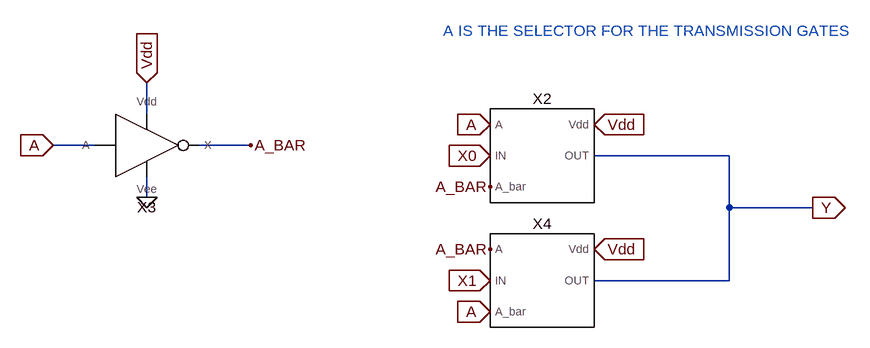
[diagram p0: schematic 2x1_MUX.asc]
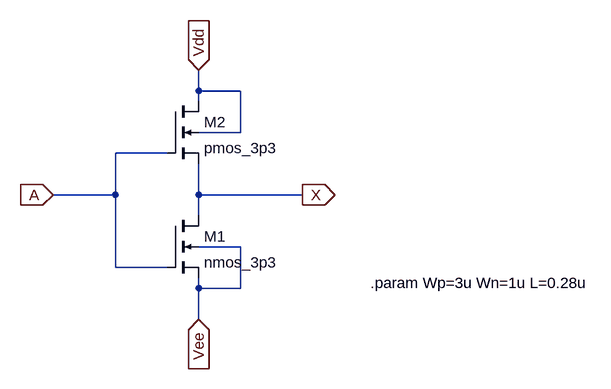
[diagram p1: sub-circuit invx1.asc]
2x1_MUX.asc, the LTspice schematic file:
Version 4
SHEET 1 1144 680
WIRE -160 16 -160 -32
WIRE -240 64 -304 64
WIRE 0 64 -80 64
WIRE 736 80 528 80
WIRE -160 144 -160 112
WIRE 736 160 736 80
WIRE 864 160 736 160
WIRE 736 272 736 160
WIRE 736 272 528 272
FLAG 528 32 Vdd
IOPIN 528 32 In
FLAG 368 80 X0
IOPIN 368 80 In
FLAG 368 32 A
IOPIN 368 32 In
FLAG -304 64 A
IOPIN -304 64 In
FLAG 0 64 A_BAR
FLAG 368 128 A_BAR
FLAG 528 224 Vdd
IOPIN 528 224 In
FLAG 864 160 Y
IOPIN 864 160 Out
FLAG 368 272 X1
IOPIN 368 272 In
FLAG 368 320 A
IOPIN 368 320 In
FLAG 368 224 A_BAR
FLAG -160 144 0
FLAG -160 -32 Vdd
IOPIN -160 -32 In
SYMBOL TGATE 448 80 R0
SYMATTR InstName X2
SYMBOL INVx1 -160 64 R0
SYMATTR InstName X3
SYMBOL TGATE 448 272 R0
SYMATTR InstName X4
TEXT 296 -112 Left 2 ;A IS THE SELECTOR FOR THE TRANSMISSION GATES

invx1.asc, the sub-circuit schematic file:
Version 4
SHEET 1 2776 836
WIRE 416 -16 416 -48
WIRE 480 -16 416 -16
WIRE 416 0 416 -16
WIRE 480 48 480 -16
WIRE 480 48 416 48
WIRE 368 80 288 80
WIRE 288 144 288 80
WIRE 288 144 192 144
WIRE 416 144 416 96
WIRE 576 144 416 144
WIRE 416 176 416 144
WIRE 480 224 416 224
WIRE 288 256 288 144
WIRE 368 256 288 256
WIRE 416 288 416 272
WIRE 480 288 480 224
WIRE 480 288 416 288
WIRE 416 336 416 288
FLAG 416 -48 Vdd
IOPIN 416 -48 In
FLAG 192 144 A
IOPIN 192 144 In
FLAG 576 144 X
IOPIN 576 144 Out
FLAG 416 336 Vee
IOPIN 416 336 In
SYMBOL nmos4 368 176 R0
SYMATTR InstName M1
SYMATTR Value nmos_3p3
SYMATTR Value2 l={L} w={Wn}
SYMBOL nmos4 368 0 R0
SYMATTR InstName M2
SYMATTR Value pmos_3p3
SYMATTR Value2 l={L} w={Wp}
TEXT 680 280 Left 2 !.param Wp=3u Wn=1u L=0.28u

The netlist it stands for:
* 2x1_MUX.asc
XX2 A A_BAR X0 Vdd Y TGATE L=0.28u Wn=1u Wp=3u M=1  ; pins A A_bar IN Vdd OUT
XX3 A Vdd A_BAR 0 invx1
XX4 A_BAR A X1 Vdd Y TGATE L=0.28u Wn=1u Wp=3u M=1  ; pins A A_bar IN Vdd OUT

* block symbol definitions
.subckt invx1 A Vdd X Vee
M1 X A Vee Vee nmos_3p3 l={L} w={Wn}
M2 Vdd A X Vdd pmos_3p3 l={L} w={Wp}
.param Wp=3u Wn=1u L=0.28u
.ends invx1

.model NMOS NMOS
.model PMOS PMOS
.lib standard.mos
* A IS THE SELECTOR FOR THE TRANSMISSION GATES
.backanno
.end